# Altium schematic sheet LED.SchDoc
size A4; CompanyName: Technische Hochschule Nürnberg Georg Simon Ohm; Organization: UltraZohm; Address1: Kesslerplatz 12; Address2: 90489 Nürnberg; Address3: GERMANY; DocumentNumber: 2; SheetNumber: 2; SheetTotal: 2; Website: www.ultrazohm.com
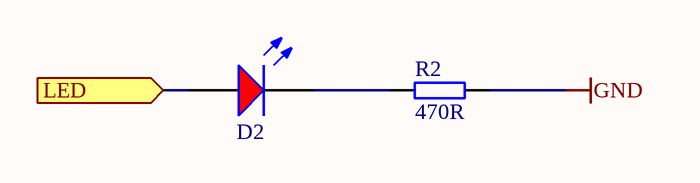
[diagram p0: LED.SchDoc]

## Parts
D2  LED Red  [WL-SMCW_0603]  (value not drawn)
R2  470R  [R_0603_TE]

## Ports
LED (in)

## Nets
GND: R2.2
LED: D2.2(A) ; port LED
NetD2_1: D2.1(K) R2.1

## Notes on the sheet
- Title
- Revision:
- Design Engineer:
- Date:
- Project:
- Sheet
- of

## Library data of the parts
D2 = UZgen_LED_0603_Red: Standard LEDs - SMD 0603 red; Manufacturer: UZgen; Created from: UZgenTool; Manufacturer Part Number: UZgen_LED_0603_Red; PartID: 22; Created On: 09/09/2024 10:45:01; ComponentLink1Description: N/A; ComponentLink1URL: N/A; Component Type: LED Diode; Device Package: 0603; Last Updated: 09/09/2024 10:45:01; Mounting Type: SMD; Supplier 1: LCSC; Supplier Part Number 1: C2286; Type: Standard; Value: LED Red; Live Cycle Status: 1; Stock number: not stored; Color: red; LCSC Part Number: C2286
R2 = UZgen_R_0603_470R: Generic resistor; Manufacturer: UZgen; Tolerance: 1 %; Created from: UZgenTool; Manufacturer Part Number: UZgen_R_0603_470R; PartID: 213; Created On: 02.07.2024 17:29:49; Device Package: 0603; Last Updated: 02.07.2024 17:29:49; Mounting Type: SMD; Value: 470R